# Altium schematic sheet V2_schematic.SchDoc
size B; SheetNumber: 1; SheetTotal: 1
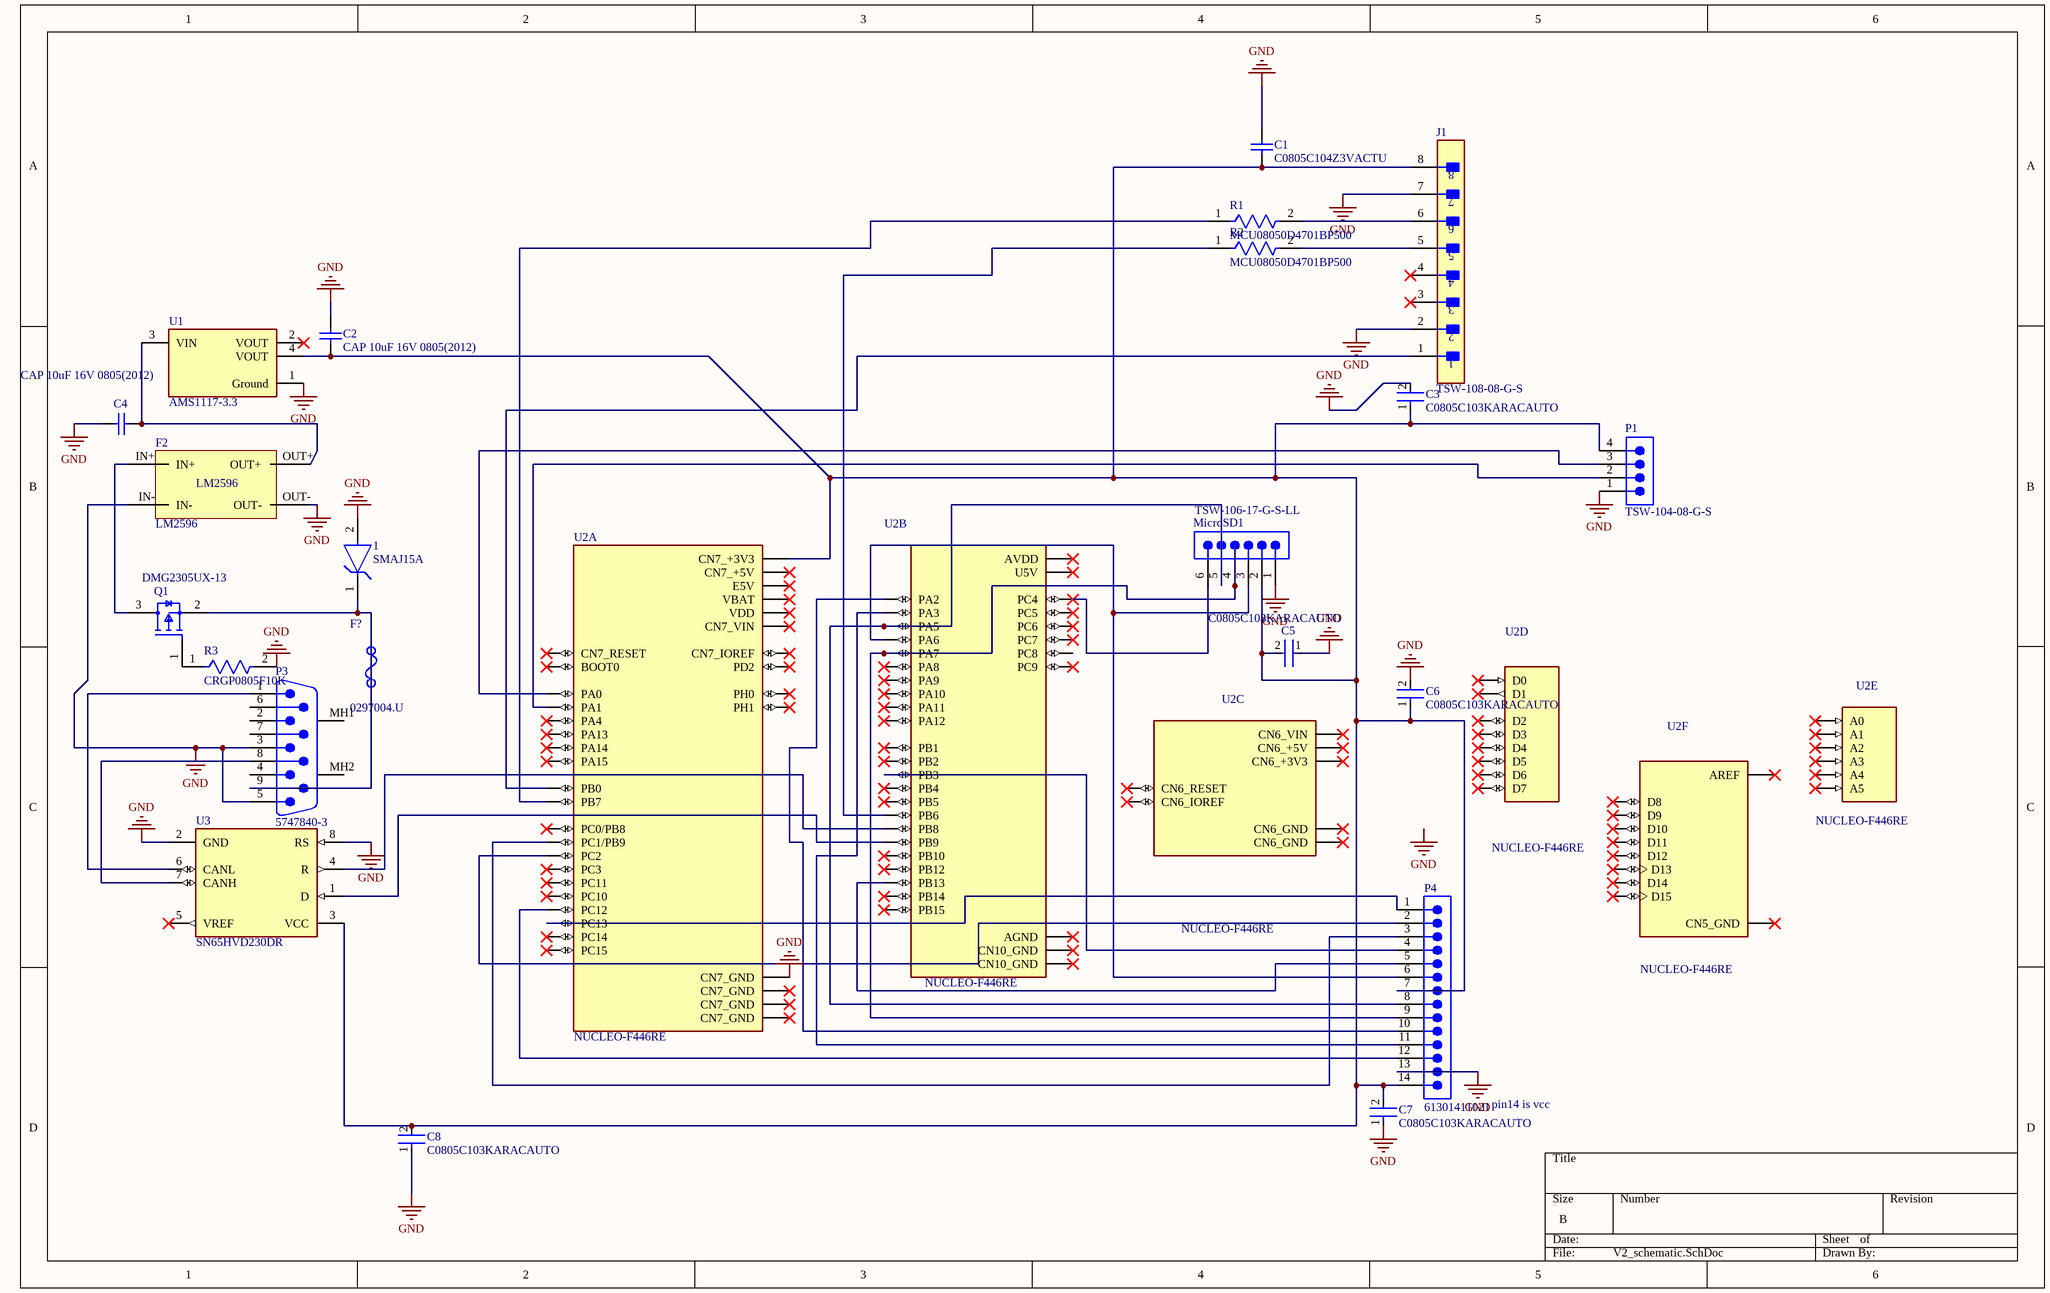
[diagram p0: V2_schematic.SchDoc]

## Parts
1  SMAJ15A  [FP-SMA-MFG]
C1  C0805C104Z3VACTU  [CAPC2013X88X50LL20T25]
C2  CAP 10uF 16V 0805(2012)  [CAPC0805(2012)145_M]
C3  C0805C103KARACAUTO  [FP-C0805C-DN-MFG]
C4  CAP 10uF 16V 0805(2012)  [CAPC0805(2012)145_M]
C5  C0805C103KARACAUTO  [FP-C0805C-DN-MFG]
C6  C0805C103KARACAUTO  [FP-C0805C-DN-MFG]
C7  C0805C103KARACAUTO  [FP-C0805C-DN-MFG]
C8  C0805C103KARACAUTO  [FP-C0805C-DN-MFG]
F2  LM2596
F?  0297004.U  [FP-0297004_U-MFG]
J1  TSW-108-08-G-S  [FP-TSW-108-08-G-S-MFG]
MicroSD1  TSW-106-17-G-S-LL  [SMTC-TSW-106-17-X-S-LL]
P1  TSW-104-08-G-S  [SMTC-TSW-104-08-X-S]
P3  5747840-3  [TECO-5747840-3_V]
P4  61301411021  [61301411021]
Q1  DMG2305UX-13  [FP-SOT23-MFG]
R1  MCU08050D4701BP500  [FP-MCU0805-MFG]
R2  MCU08050D4701BP500  [FP-MCU0805-MFG]
R3  CRGP0805F10K  [FP-CRGP0805-IPC_C]
U1  AMS1117-3.3  [FP-AMS1117-IPC_C]
U2  NUCLEO-F446RE  [MODULE_NUCLEO-F446RE]  (parts A,B,C,D,E,F of 6)
U3  SN65HVD230DR  [FP-D0008A-IPC_A]

## Nets
GND: 1.2(A) C1.1 C2.1 C3.2 C4.1 C5.1 C6.2 C7.1 C8.1 F2.IN- F2.OUT- J1.2 J1.7 MicroSD1.1 P1.1 P3.3 P3.5 P4.13 R3.2 U1.1(Ground) U2.CN7_8(CN7_GND) U3.2(GND) U3.8(RS)
Net1_1: 1.1(C) P3.9 Q1.2(S)
NetC1_2: C1.2 C2.2 C3.1 C5.2 C6.1 C7.2 C8.2 J1.8 MicroSD1.2 P1.4 P4.7 P4.14 U1.4(VOUT) U2.CN7_16(CN7_+3V3) U3.3(VCC)
NetC4_2: C4.2 F2.OUT+ U1.3(VIN)
NetF2_IN+: F2.IN+ Q1.3(D)
NetJ1_1: J1.1 U2.CN7_34(PB0)
NetJ1_5: J1.5 R2.2
NetJ1_6: J1.6 R1.2
NetMicroSD1_3: MicroSD1.3 P4.6 U2.CN10_13(PA6)
NetMicroSD1_4: MicroSD1.4 P4.9 U2.CN10_15(PA7)
NetMicroSD1_5: MicroSD1.5 P4.8 U2.CN10_11(PA5)
NetMicroSD1_6: MicroSD1.6 U2.CN10_34(PC4)
NetP1_2: P1.2 U2.CN7_30(PA1)
NetP1_3: P1.3 U2.CN7_28(PA0)
NetP3_1: P3.1 U3.6(CANL)
NetP3_8: P3.8 U3.7(CANH)
NetP4_1: P4.1 U2.CN7_23(PC13)
NetP4_2: P4.2 U2.CN7_35(PC2)
NetP4_3: P4.3 U2.CN7_36(PC1/PB9)
NetP4_4: P4.4 U2.CN10_31(PB3)
NetP4_5: P4.5 U2.CN10_30(PB13)
NetP4_10: P4.10 U2.CN10_35(PA2)
NetP4_11: P4.11 U2.CN10_37(PA3)
NetP4_12: P4.12 U2.CN7_3(PC12)
NetQ1_1: Q1.1(G) R3.1
NetR1_1: R1.1 U2.CN7_21(PB7)
NetR2_1: R2.1 U2.CN10_17(PB6)
NetU2_CN10_3: U2.CN10_3(PB8) U3.4(R)
NetU2_CN10_5: U2.CN10_5(PB9) U3.1(D)

Not connected (* = marked no-connect by the designer): J1 3* 4*; P3 2 4 6 7 MH1 MH2; U1 2(VOUT)*; U2 CN5_1(D8)* CN5_2(D9)* CN5_3(D10)* CN5_4(D11)* CN5_5(D12)* CN5_6(D13)* CN5_7(CN5_GND)* CN5_8(AREF)* CN5_9(D14)* CN5_10(D15)* CN6_2(CN6_IOREF)* CN6_3(CN6_RESET)* CN6_4(CN6_+3V3)* CN6_5(CN6_+5V)* CN6_6(CN6_GND)* CN6_7(CN6_GND)* CN6_8(CN6_VIN)* CN7_1(PC10)* CN7_2(PC11)* CN7_4(PD2)* CN7_5(VDD)* CN7_6(E5V)* CN7_7(BOOT0)* CN7_12(CN7_IOREF)* CN7_13(PA13)* CN7_14(CN7_RESET)* CN7_15(PA14)* CN7_17(PA15)* CN7_18(CN7_+5V)* CN7_19(CN7_GND)* CN7_20(CN7_GND)* CN7_22(CN7_GND)* CN7_24(CN7_VIN)* CN7_25(PC14)* CN7_27(PC15)* CN7_29(PH0)* CN7_31(PH1)* CN7_32(PA4)* CN7_33(VBAT)* CN7_37(PC3)* CN7_38(PC0/PB8)* CN8_1(A0)* CN8_2(A1)* CN8_3(A2)* CN8_4(A3)* CN8_5(A4)* CN8_6(A5)* CN9_1(D0)* CN9_2(D1)* CN9_3(D2)* CN9_4(D3)* CN9_5(D4)* CN9_6(D5)* CN9_7(D6)* CN9_8(D7)* CN10_1(PC9)* CN10_2(PC8) CN10_4(PC6)* CN10_6(PC5)* CN10_7(AVDD)* CN10_8(U5V)* CN10_9(CN10_GND)* CN10_12(PA12)* CN10_14(PA11)* CN10_16(PB12)* CN10_19(PC7)* CN10_20(CN10_GND)* CN10_21(PA9)* CN10_22(PB2)* CN10_23(PA8)* CN10_24(PB1)* CN10_25(PB10)* CN10_26(PB15)* CN10_27(PB4)* CN10_28(PB14)* CN10_29(PB5)* CN10_32(AGND)* CN10_33(PA10)*; U3 5(VREF)*

## Notes on the sheet
- pin14 is vcc
- Labels drawn without touching a wire or pin: GND

## Library data of the parts
1 = CMP-07401-000026-1: TVS DIODE 15V 24.4V SMA; Manufacturer: Bourns Inc.; Max Junction Temp: +150°C; Peak Pulse Current: 16.4A; Direction: Unidirectional; Breakdown Voltage: 16.7V; Number Of Channels: 1; Peak Pulse Power: 400W; Description: 24.4V Clamp 16.4A Ipp Tvs Diode Surface Mount SMA (DO-214AC); Mouser Description: Bourns Smaj15a / Diode Tvs 15v 400w Uni 5% Smd Bourns; Temperature Range Low: -55°C; ComponentLink2Description: Datasheet; Package: SMA; Reverse Standoff Voltage: 15V; Category: Diode; Device Class L2: TVS Diodes; Lead Free: Yes; RoHS: TRUE; Clamping Voltage: 24.4V; ComponentLink2URL: https://www.bourns.com/docs/Product-Datasheets/SMAJ.pdf; Digikey Description: TVS DIODE 15V 24.4V SMA; Temperature Range High: +150°C; Height: 2.29mm; Device Class L1: Circuit Protection; Device Class L3: unset; Temperature: -55°C to +150°C; Octopart: https://octopart.com/smaj15a-bourns-12809353; Manufacturer Part Number: SMAJ15A; Automotive: No
C1 = CMP-2007-00284-1: Manufacturer: Kemet; Part Number: C0805C104Z3VACTU
C2 C4 = CMP-1036-04931-1: CAP 10uF 16V -20% to +80% 0805 (2012 Metric) Thickness 1.45mm SMD; Case-Metric: 2012; Case-EIA: 0805; Value: 10uF; Tolerance: -20% to +80%; Max Thickness: 1.45 mm; Rated Voltage: 16 V; Technology: SMT
C3 C5-C8 = CMP-03020-020823-2: CAP CER 10000PF 250V X7R 0805; Manufacturer: KEMET; Tolerance: 0.1; Material: Ceramic; Temperature Coefficient: 30ppm/°C; Capacitance: 10,000 pF; Value: 10,000 pF; Description: C0805 10,000 pF X7R 30ppm/°C 10.00% 250 V; Device Class L3: Ceramic Capacitors; Manufacturer Part Number: C0805C103KARACAUTO; Digikey Description: CAP CER 10000PF 250V X7R 0805; RoHS: TRUE; Ipc Land Pattern Name: CAPC200125X78; Automotive: No; ComponentLink2URL: https://content.kemet.com/datasheets/KEM_C1003_C0G_SMD.pdf; Category: Cap; Temperature Characteristic: X7R; Device Class L2: Capacitors; Height: 0.88mm; Octopart: https://octopart.com/c0805c103karacauto-kemet-31031912; Device Class L1: Passive Components; Lead Free: Yes; ComponentLink2Description: Datasheet; Package: C0805C-DN; Temperature: -55°C to +125°C; Voltage Rating: 250 V; Temperature Range High: +125°C; Mouser Description: Multilayer Ceramic Capacitors MLCC - SMD/SMT 250volts 0.01uF 10% X7R AUTO; Temperature Range Low: -55°C
F? = CMP-00227-23028987-1: 0297004.U Fuse Blade Fast Acting 4A 32V Socket 10.9 X 3.8 X 8.8mm Polyamide 66 Automotive UL; Color: Pink; Resistance: 23.48mΩ; Schedule B: 8536100040; Depth: 3.8mm; Voltage Rating (DC): 32V; Housing Material: Polyamide; Min Operating Temperature: -40°C; Fuse Current: 4A; RoHS: Compliant; NexarPartId: 23028987; Mount: Holder, Socket; Lead Free: Lead Free; Height: 8.8mm; Max Operating Temperature: 125°C; Current Rating: 4A; Voltage Rating: 32V; Packaging: Bulk; Width: 3.81mm; Approvals: UL; Length: 10.9mm
J1 = CMP-02766-000001-1: CONN HEADER VERT 8POS 2.54MM; Manufacturer: Samtec; Number Of Contacts: 8; Conn Orientation: Straight; Conn Gender: Male; Device Class L1: Connectors; ComponentLink2Description: Datasheet; Digikey Description: CONN HEADER VERT 8POS 2.54MM; ComponentLink2URL: http://suddendocs.samtec.com/catalog_english/tsw_th.pdf; Temperature: -55°C to +125°C; RoHS: TRUE; Mouser Description: TSW - Samtec 2.54mm Pin Header 13.46mm Overall Pin Length 5.08mm Tail; Automotive: No; Temperature Range High: +125°C; Package: TSW-108-08-G-S; Device Class L3: unset; Manufacturer Part Number: TSW-108-08-G-S; Pitch: 2.54mm; Number Of Rows: 1; Lead Free: Yes; Height: 8.71mm; Contact Material: Gold,Nickel; Footprint Url: http://suddendocs.samtec.com/prints/tsw-xxx-xx-x-x-xx-xxx-footprint.pdf; Temperature Range Low: -55°C; Octopart: https://octopart.com/tsw-108-08-g-s-samtec-272653; Category: Conn; Device Class L2: Headers and Wire Housings
MicroSD1 = CMP-1024-00391-1: 0.025" SQ Post Header, Through-hole, Vertical, -55 to 125 degC, 2.54 mm Pitch, 6-Pin, Male, RoHS; Manufacturer: Samtec; Pitch: 2.54 mm; ComponentLink3Description: Package Specification; Temperature Range: -55 to 125 degC; ComponentLink1Description: Manufacturer URL; ComponentLink2Description: Datasheet; Orientation: Vertical; DatasheetVersion: F-214; Mounting Technology: Through-hole; RoHS: True; PartNumber: TSW-106-17-G-S-LL; ComponentLink2URL: http://www.samtec.com/documents/webfiles/pdf/TSW_TH.PDF; PackageReference: TSW-106-17-X-S-LL; PackageVersion: DM, 8/1988; ComponentLink3URL: http://www.samtec.com/documents/webfiles/cpdf/TSW-XXX-XX-XXX-X-XX-XXX-MKT.pdf; PackageDescription: .025[0.64] SQ. Post Terminal Strip Assembly; ComponentLink1URL: http://www.samtec.com
P1 = CMP-1024-00357-1: 0.025" SQ Post Header, Through-hole, Vertical, -55 to 125 degC, 2.54 mm Pitch, 4-Pin, Male, RoHS; Manufacturer: Samtec; Pitch: 2.54 mm; RoHS: True; ComponentLink3URL: http://www.samtec.com/documents/webfiles/cpdf/TSW-XXX-XX-XXX-X-XX-XXX-MKT.pdf; Mounting Technology: Through-hole; ComponentLink2URL: http://www.samtec.com/documents/webfiles/pdf/TSW_TH.PDF; ComponentLink1URL: http://www.samtec.com; ComponentLink3Description: Package Specification; PackageVersion: DM, 8/1988; ComponentLink2Description: Datasheet; PackageReference: TSW-104-08-X-S; PackageDescription: .025[0.64] SQ. Post Terminal Strip Assembly; PartNumber: TSW-104-08-G-S; ComponentLink1Description: Manufacturer URL; Temperature Range: -55 to 125 degC; DatasheetVersion: F-214; Orientation: Vertical
P3 = CMP-2000-05647-1: Male D-Sub Connector, Pitch 2.74 mm, 2 Row, 9 Position, Height 12.93 mm, Tail Length 3.17 mm, -55 to 105 degC, RoHS, Tray; Manufacturer: TE Connectivity; Current Rating: 6A; Flange Feature: Housing/Shell(4-40); Catalog Drawings: AMPD-SubMale.318; Dynamic Catalog: AMPLIMITEHD-20Series; Number of Positions: 9; Voltage Rating: 125V; Other Names: A32091; Mating Products: 5-747905-7-ND / -CONND-SUBRCPT9POSVERTSLD / 5-787355-1-ND / -CONNRCPT9POSVERTSOLDERCUP / 5746861-4-ND / -CONNRECEPT9POSGOLDIDC / A32510-ND / -CONND-SUBRCPT9POSSLDCUPAU / AFL09B-ND / -CONND-SUBRECEPT9POS30GOLD / A31975-ND / -CONND-SUBRECEPT9P22-26AWGAU / A31974-ND / -CONND-SUBRECEPT9P20-22AWGAU / A31973-ND / -CONND-SUBRECEPT9P26-30AWGAU / A31931-ND / -CONND-SUBRCPT9POS22-26AWGAU; 3D Model: 5747840-3.pdf; Connector Type: Plug,MalePins; Product Training Modules: AMPLIMITED-SubConnectors; Featured Product: AMPLIMITED-SubminiatureConnectors; Contact Finish Thickness: Flash; Operating Temperature: -55°C~105°C; Shell Material, Finish: Steel,TinPlated; Datasheet URL: http://www.te.com/commerce/DocumentDelivery/DDEController?Action=srchrtrv&DocNm=5747840&DocType=Customer+Drawing&DocLang=English; Shell Size, Connector Layout: 1(DE,E); Package Description: Male D-Sub Connector, Pitch 2.74 mm, 2 Row, 9 Position, Height 12.93 mm, Tail Length 3.17 mm; Package Reference: 5747840-3; Mounting Technology: ThroughHole; Contact Type: Signal; Standard Package: 130; Family: D-SubConnectors; Manufacturer URL: http://www.te.com/; Contact Finish: Gold; Category: Connectors,Interconnects; RoHS Information: 5747840-3StatementofCompliance; Color: Black; Number of Rows: 2; Connector Style: D-Sub; Series: AMPLIMITEHD-20; Mounting Type: ThroughHole,RightAngle; Features: BoardLock,GroundStrap,GroundingIndents; Datasheet Version: Rev. D, 01/2013; Termination: Solder
P4 = CMP-1502-01090-4: THT Angled Pin Header WR-PHD, Pitch 2.54 mm, Single Row, 14 pins; Number of Positions: 14; Pitch: 2.54mm; Connector Type: Male Pin; Gender: Male; Current Rating: 3A; Operating Supply Voltage: 250V; Contact Resistance: 20mΩ; Color: Black; Number of Pins: 14; Lead Pitch: 2.54mm; Mount: Through Hole; Contact Mating Length: 5.9944mm; Contact Plating: Gold; Packaging: Bulk; Termination: Solder; Contact Material: Copper; RoHS: Compliant; Number of Rows: 1; Number of Contacts: 14
Q1 = CMP-12801-000021-1: MOSFET P-CH 20V 4.2A SOT23; Manufacturer: Diodes Inc.; Input Capacitace At Vds: 808pF @ -15V; Rthja Max: 90°C/W; Drain To Source Voltage: -20V; Standoff Height: 0.013mm; Number Of P Channels: 1; Gate To Source Voltage: 8V; Turn On Delay Time: 10.8ns; Pulse Drain Current: -15A; Threshold Vgs Max: -0.9V; Max Junction Temp: +150°C; Depletion Mode: False; Drain To Source Resistance: 40mΩ; Threshold Vgs Min: -0.5V; Continuous Drain Current: -4.2A; Turn Off Delay Time: 79.3ns; Gate Charge At Vgs: 10.2nC @ -4.5V; Power Dissipation: 1.4W; Description: P-Channel 20V 4.2A (Ta) 1.4W (Ta) Surface Mount SOT-23; Digikey Description: MOSFET P-CH 20V 4.2A SOT23; Temperature Range High: +150°C; Height: 1.1mm; Package: SOT23; Footprint Url: https://www.diodes.com/assets/Package-Files/SOT23.pdf; Device Class L3: MOSFETs; RoHS: TRUE; Temperature: -55°C to +150°C; Mouser Description: MOSFET P-Ch ENH FET -20V 52mOhm -5.0V; Temperature Range Low: -55°C; ComponentLink2Description: Datasheet; Manufacturer Part Number: DMG2305UX-13; Octopart: https://octopart.com/dmg2305ux-13-diodes+inc.-29925594; Ipc Land Pattern Name: SOT92P240X102-3; Device Class L2: Transistors; Automotive: No; Number Of Channels: 1; Drain To Source Breakdown Voltage: -20V; Lead Free: Yes; Device Class L1: Discrete Semiconductors; Category: Trans; ComponentLink2URL: https://www.diodes.com/assets/Datasheets/DMG2305UX.pdf
R1 R2 = CMP-02407-001466-1: RES 1.05K OHM 0.5% 1/5W 0805; Max Power Dissipation: 125mW; Tolerance: 0.1%; Temperature Coefficient: 25ppm/°C; Resistance: 4.7kR; Composition: Thin Film; Case/Package: 0805; Lead Free: Lead Free; Min Operating Temperature: -55°C; Package Quantity: 5000; Packaging: Tape and Reel; Width: 0.049inch; Height: 0.022inch; Depth: 1.25mm; Number of Terminations: 2; Military Standard: Not; Max Operating Temperature: 125°C; Length: 0.079inch
R3 = CMP-03211-006861-1: CRGP 0805 10K 1%; Manufacturer: TE; Power Rating: 0.33W; Voltage Rating: 150V; Value: 10KΩ; Tolerance: 0.01; Temperature Coefficient: ±100ppm/°C; Description: CRGP0805 10KΩ 0.33W ±100ppm/°C 1% 150V; Manufacturer Part Number: CRGP0805F10K; ComponentLink2URL: https://www.mouser.com/datasheet/2/418/NG_DS_9-1773463-9_A-1358566.pdf; Temperature Range Low: -55°C; Ipc Land Pattern Name: RESC200125X55; Device Class L2: Resistors; Automotive: No; Device Class L3: Chip SMD Resistors; Composition: Thick Film; Temperature Range High: +155°C; Temperature: -55°C to +155°C; Height: 0.65mm; Series: CRGP; RoHS: TRUE; Device Class L1: Passive Components; Octopart: https://octopart.com/crgp0805f10k-te+connectivity-91018782; Package: CRGP0805; Digikey Description: CRGP 0805 10K 1%; Ambient Temperature Range High: +70°C; Lead Free: Yes; ComponentLink2Description: Datasheet; Category: Res; Resistance: 10KΩ
U1 = CMP-209535-000001-1: LDO Voltage Regulators 1A, 3.3V; Manufacturer: Advanced Monolithic Systems; Dropout Voltage: 1.1V; Output Type: Fixed; Nominal Supply Current: 5mA; Max Power Dissipation: 1.2W; Max Supply Voltage: 15V; Number Of Outputs: 1; Standoff Height: 0.64mm; Max Junction Temp: +125°C; Height: 1.8mm; Package: AMS1117; Device Class L2: Power Management ICs; ComponentLink2Description: Datasheet; ComponentLink2URL: http://www.advanced-monolithic.com/pdf/ds1117.pdf; Category: IC; RoHS: TRUE; Automotive: No; Device Class L1: Integrated Circuits (ICs); Output Current: 1A; Device Class L3: Voltage Regulators - Linear; Temperature: -40°C to +125°C; Output Voltage: 3.3V; Manufacturer Part Number: AMS1117-3.3; Temperature Range Low: -40°C; Octopart: https://octopart.com/ams1117-3.3-advanced+monolithic+systems-25899300; Lead Free: Yes; Ipc Land Pattern Name: SOT229P700X180-4; Temperature Range High: +125°C
U2 = NUCLEO-F446RE: STM32F446RE, mbed-Enabled Development Nucleo-64 STM32F4 ARMÂ® CortexÂ®-M4 MCU 32-Bit Embedded Evaluation Board; MF: STMicroelectronics; SnapEDA_Link: https://www.snapeda.com/parts/NUCLEO-F446RE/STMicroelectronics/view-part/?ref=snap; Package: None; Value: *; MP: NUCLEO-F446RE; Check_prices: https://www.snapeda.com/parts/NUCLEO-F446RE/STMicroelectronics/view-part/?ref=eda
U3 = CMP-0315-00015-3: IC TRANSCEIVER HALF 1/1 8SOIC; Number of Transceivers: 1; Operating Supply Voltage: 3.3V; Number of I/Os: 2; Max Supply Current: 17mA; Max Supply Voltage: 3.6V; Min Supply Voltage: 3V; Data Rate: 1Mbps; Min Operating Temperature: -40°C; Packaging: Tape and Reel; Lead Free: Lead Free; Number of Transmit Buffers: 1; Max Operating Temperature: 85°C; Number of Receive Buffers: 1; Number of Pins: 8; Package Quantity: 1; Radiation Hardening: No; Case/Package: D; REACH SVHC: No SVHC; Weight: 0.002561oz; Termination: SMD/SMT; Contact Plating: Gold; Nominal Supply Current: 17mA; Number of Receivers: 1; Number of Drivers: 1